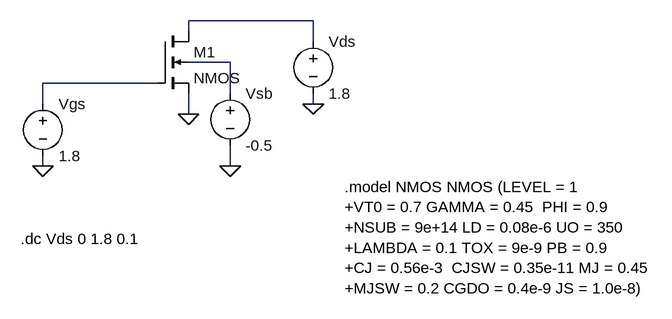
[diagram p0: schematic nmosdccharacteristics.asc]
nmosdccharacteristics.asc, the LTspice schematic file:
Version 4
SHEET 1 940 680
WIRE 384 128 192 128
WIRE 192 144 192 128
WIRE 384 160 384 128
WIRE 256 192 192 192
WIRE 144 224 -32 224
WIRE 256 240 256 192
WIRE -32 256 -32 224
WIRE 384 256 384 240
WIRE 192 272 192 240
WIRE -32 352 -32 336
WIRE 256 352 256 320
FLAG 384 256 0
FLAG -32 352 0
FLAG 192 272 0
FLAG 256 352 0
SYMBOL voltage 384 144 R0
WINDOW 123 0 0 Left 0
WINDOW 39 0 0 Left 0
SYMATTR InstName Vds
SYMATTR Value 1.8
SYMBOL voltage -32 240 R0
WINDOW 123 0 0 Left 0
WINDOW 39 0 0 Left 0
SYMATTR InstName Vgs
SYMATTR Value 1.8
SYMBOL voltage 256 224 R0
WINDOW 123 0 0 Left 0
WINDOW 39 0 0 Left 0
SYMATTR InstName Vsb
SYMATTR Value -0.5
SYMBOL nmos4 144 144 R0
SYMATTR InstName M1
TEXT 432 384 Left 2 !.model NMOS NMOS (LEVEL = 1\n+VT0 = 0.7 GAMMA = 0.45  PHI = 0.9\n+NSUB = 9e+14 LD = 0.08e-6 UO = 350\n+LAMBDA = 0.1 TOX = 9e-9 PB = 0.9\n+CJ = 0.56e-3  CJSW = 0.35e-11 MJ = 0.45\n+MJSW = 0.2 CGDO = 0.4e-9 JS = 1.0e-8)
TEXT -66 464 Left 2 !.dc Vds 0 1.8 0.1

The netlist it stands for:
* nmosdccharacteristics.asc
Vds N001 0 1.8
Vgs N003 0 1.8
Vsb N002 0 -0.5
M1 N001 N003 0 N002 NMOS
.model NMOS NMOS
.model PMOS PMOS
.lib standard.mos
.model NMOS NMOS (LEVEL = 1
+VT0 = 0.7 GAMMA = 0.45  PHI = 0.9
+NSUB = 9e+14 LD = 0.08e-6 UO = 350
+LAMBDA = 0.1 TOX = 9e-9 PB = 0.9
+CJ = 0.56e-3  CJSW = 0.35e-11 MJ = 0.45
+MJSW = 0.2 CGDO = 0.4e-9 JS = 1.0e-8)
.dc Vds 0 1.8 0.1
.backanno
.end